# EAGLE design Powersupply V1.10_final (EAGLE 7.2.0)
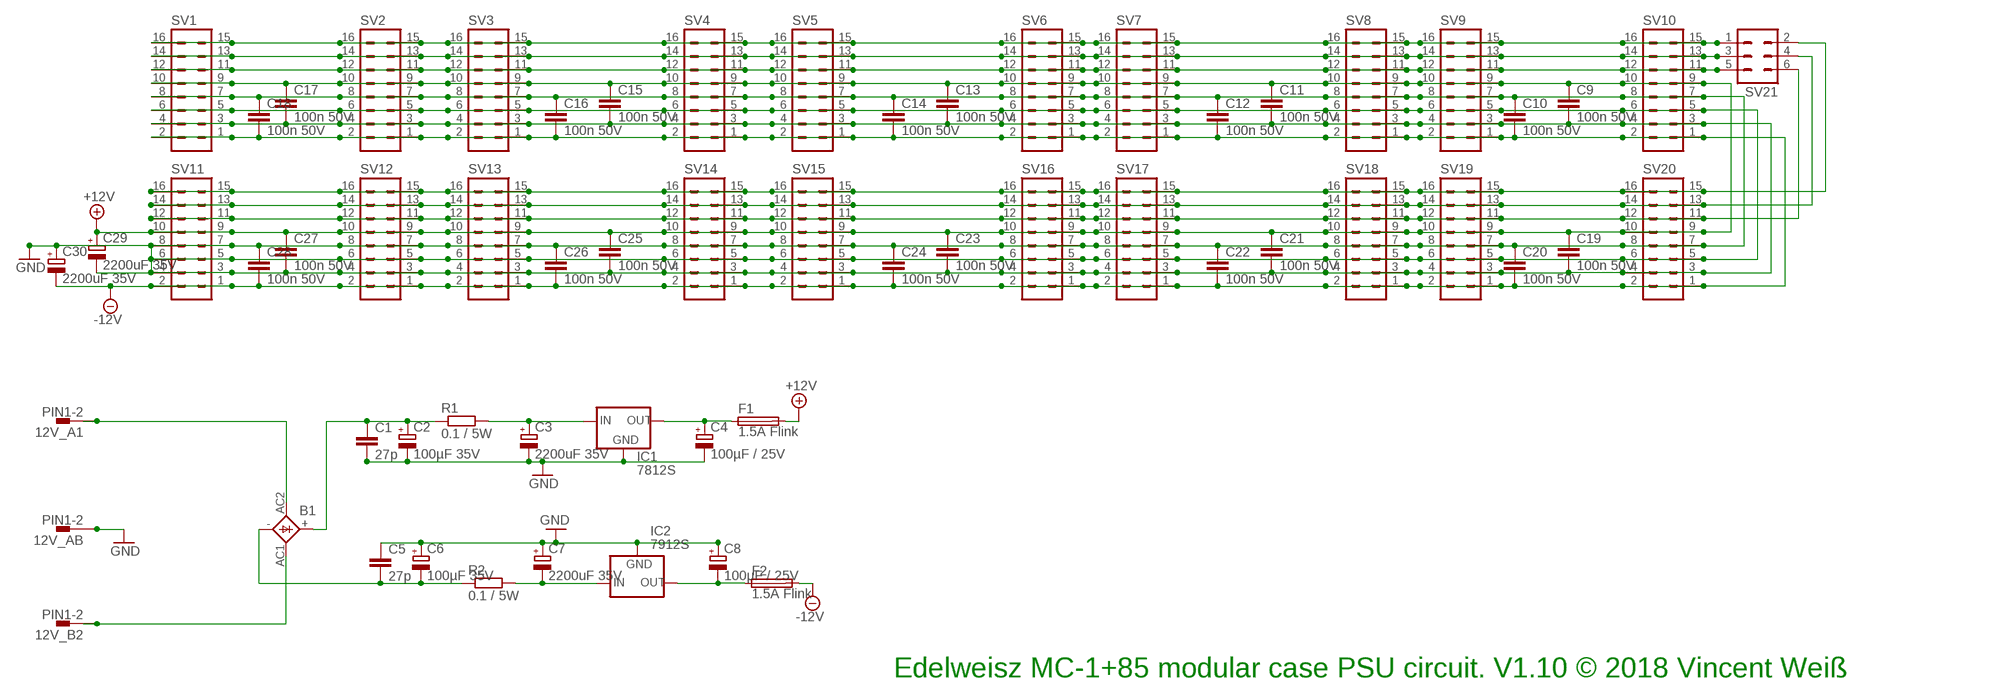
[diagram p0: schematic, sheet 1]

## Parts
12V_A1  PIN1-2  [62221]
12V_AB  PIN1-2  [62221]
12V_B2  PIN1-2  [62221]
B1  GBU4  [GBU4S]
C1  27p  C-EU050-024X044  [C050-024X044]
C2  100µF 35V  CPOL-EUE2.5-7  [E2,5-7]
C3  2200uF 35V  CPOL-EUE7.5-16  [E7,5-16]
C4  100µF / 25V  CPOL-EUE2.5-7  [E2,5-7]
C5  27p  C-EU050-024X044  [C050-024X044]
C6  100µF 35V  CPOL-EUE2.5-7  [E2,5-7]
C7  2200uF 35V  CPOL-EUE7.5-16  [E7,5-16]
C8  100µF / 25V  CPOL-EUE2.5-7  [E2,5-7]
C9  100n 50V  C-EU025-025X050  [C025-025X050]
C10  100n 50V  C-EU025-025X050  [C025-025X050]
C11  100n 50V  C-EU025-025X050  [C025-025X050]
C12  100n 50V  C-EU025-025X050  [C025-025X050]
C13  100n 50V  C-EU025-025X050  [C025-025X050]
C14  100n 50V  C-EU025-025X050  [C025-025X050]
C15  100n 50V  C-EU025-025X050  [C025-025X050]
C16  100n 50V  C-EU025-025X050  [C025-025X050]
C17  100n 50V  C-EU025-025X050  [C025-025X050]
C18  100n 50V  C-EU025-025X050  [C025-025X050]
C19  100n 50V  C-EU025-025X050  [C025-025X050]
C20  100n 50V  C-EU025-025X050  [C025-025X050]
C21  100n 50V  C-EU025-025X050  [C025-025X050]
C22  100n 50V  C-EU025-025X050  [C025-025X050]
C23  100n 50V  C-EU025-025X050  [C025-025X050]
C24  100n 50V  C-EU025-025X050  [C025-025X050]
C25  100n 50V  C-EU025-025X050  [C025-025X050]
C26  100n 50V  C-EU025-025X050  [C025-025X050]
C27  100n 50V  C-EU025-025X050  [C025-025X050]
C28  100n 50V  C-EU025-025X050  [C025-025X050]
C29  2200uF 35V  CPOL-EUE7.5-16  [E7,5-16]
C30  2200uF 35V  CPOL-EUE7.5-16  [E7,5-16]
F1  1.5A Flink  SH22,5  [SH22,5]
F2  1.5A Flink  SH22,5  [SH22,5]
IC1  7812S  78XXS  [78XXS]
IC2  7912S  79XXS  [79XXS]
R1  0.1 / 5W  R-EU_0613/15  [P0613/15]
R2  0.1 / 5W  R-EU_0613/15  [P0613/15]
SV1  ML16  [ML16]
SV2  ML16  [ML16]
SV3  ML16  [ML16]
SV4  ML16  [ML16]
SV5  ML16  [ML16]
SV6  ML16  [ML16]
SV7  ML16  [ML16]
SV8  ML16  [ML16]
SV9  ML16  [ML16]
SV10  ML16  [ML16]
SV11  ML16  [ML16]
SV12  ML16  [ML16]
SV13  ML16  [ML16]
SV14  ML16  [ML16]
SV15  ML16  [ML16]
SV16  ML16  [ML16]
SV17  ML16  [ML16]
SV18  ML16  [ML16]
SV19  ML16  [ML16]
SV20  ML16  [ML16]
SV21  MA03-2  [MA03-2]

## Nets
+12V: C9.1 C11.1 C13.1 C15.1 C17.1 C19.1 C21.1 C23.1 C25.1 C27.1 C29.+ F1.2 SV1.9 SV1.10 SV2.9 SV2.10 SV3.9 SV3.10 SV4.9 SV4.10 SV5.9 SV5.10 SV6.9 SV6.10 SV7.9 SV7.10 SV8.9 SV8.10 SV9.9 SV9.10 SV10.9 SV10.10 SV11.9 SV11.10 SV12.9 SV12.10 SV13.9 SV13.10 SV14.9 SV14.10 SV15.9 SV15.10 SV16.9 SV16.10 SV17.9 SV17.10 SV18.9 SV18.10 SV19.9 SV19.10 SV20.9 SV20.10
-12V: C10.2 C12.2 C14.2 C16.2 C18.2 C20.2 C22.2 C24.2 C26.2 C28.2 C30.- F2.2 SV1.1 SV1.2 SV2.1 SV2.2 SV3.1 SV3.2 SV4.1 SV4.2 SV5.1 SV5.2 SV6.1 SV6.2 SV7.1 SV7.2 SV8.1 SV8.2 SV9.1 SV9.2 SV10.1 SV10.2 SV11.1 SV11.2 SV12.1 SV12.2 SV13.1 SV13.2 SV14.1 SV14.2 SV15.1 SV15.2 SV16.1 SV16.2 SV17.1 SV17.2 SV18.1 SV18.2 SV19.1 SV19.2 SV20.1 SV20.2
GND: 12V_AB.1 C1.2 C2.- C3.- C4.- C5.1 C6.+ C7.+ C8.+ C9.2 C10.1 C11.2 C12.1 C13.2 C14.1 C15.2 C16.1 C17.2 C18.1 C19.2 C20.1 C21.2 C22.1 C23.2 C24.1 C25.2 C26.1 C27.2 C28.1 C29.- C30.+ IC1.GND IC2.GND SV1.3 SV1.4 SV1.5 SV1.6 SV1.7 SV1.8 SV2.3 SV2.4 SV2.5 SV2.6 SV2.7 SV2.8 SV3.3 SV3.4 SV3.5 SV3.6 SV3.7 SV3.8 SV4.3 SV4.4 SV4.5 SV4.6 SV4.7 SV4.8 SV5.3 SV5.4 SV5.5 SV5.6 SV5.7 SV5.8 SV6.3 SV6.4 SV6.5 SV6.6 SV6.7 SV6.8 SV7.3 SV7.4 SV7.5 SV7.6 SV7.7 SV7.8 SV8.3 SV8.4 SV8.5 SV8.6 SV8.7 SV8.8 SV9.3 SV9.4 SV9.5 SV9.6 SV9.7 SV9.8 SV10.3 SV10.4 SV10.5 SV10.6 SV10.7 SV10.8 SV11.3 SV11.4 SV11.5 SV11.6 SV11.7 SV11.8 SV12.3 SV12.4 SV12.5 SV12.6 SV12.7 SV12.8 SV13.3 SV13.4 SV13.5 SV13.6 SV13.7 SV13.8 SV14.3 SV14.4 SV14.5 SV14.6 SV14.7 SV14.8 SV15.3 SV15.4 SV15.5 SV15.6 SV15.7 SV15.8 SV16.3 SV16.4 SV16.5 SV16.6 SV16.7 SV16.8 SV17.3 SV17.4 SV17.5 SV17.6 SV17.7 SV17.8 SV18.3 SV18.4 SV18.5 SV18.6 SV18.7 SV18.8 SV19.3 SV19.4 SV19.5 SV19.6 SV19.7 SV19.8 SV20.3 SV20.4 SV20.5 SV20.6 SV20.7 SV20.8
N$1: B1.- C5.2 C6.- R2.1
N$2: 12V_A1.1 B1.AC2(AC1)
N$3: 12V_B2.1 B1.AC1(AC2)
N$4: B1.+ C1.1 C2.+ R1.1
N$5: C3.+ IC1.IN R1.2
N$6: C7.- IC2.IN R2.2
N$7: C4.+ F1.1 IC1.OUT
N$8: C8.- F2.1 IC2.OUT
N$9: SV1.15 SV1.16 SV2.15 SV2.16 SV3.15 SV3.16 SV4.15 SV4.16 SV5.15 SV5.16 SV6.15 SV6.16 SV7.15 SV7.16 SV8.15 SV8.16 SV9.15 SV9.16 SV10.15 SV10.16 SV21.1
N$10: SV1.13 SV1.14 SV2.13 SV2.14 SV3.13 SV3.14 SV4.13 SV4.14 SV5.13 SV5.14 SV6.13 SV6.14 SV7.13 SV7.14 SV8.13 SV8.14 SV9.13 SV9.14 SV10.13 SV10.14 SV21.3
N$11: SV1.11 SV1.12 SV2.11 SV2.12 SV3.11 SV3.12 SV4.11 SV4.12 SV5.11 SV5.12 SV6.11 SV6.12 SV7.11 SV7.12 SV8.11 SV8.12 SV9.11 SV9.12 SV10.11 SV10.12 SV21.5
N$17: SV11.11 SV11.12 SV12.11 SV12.12 SV13.11 SV13.12 SV14.11 SV14.12 SV15.11 SV15.12 SV16.11 SV16.12 SV17.11 SV17.12 SV18.11 SV18.12 SV19.11 SV19.12 SV20.11 SV20.12 SV21.6
N$18: SV11.13 SV11.14 SV12.13 SV12.14 SV13.13 SV13.14 SV14.13 SV14.14 SV15.13 SV15.14 SV16.13 SV16.14 SV17.13 SV17.14 SV18.13 SV18.14 SV19.13 SV19.14 SV20.13 SV20.14 SV21.4
N$19: SV11.15 SV11.16 SV12.15 SV12.16 SV13.15 SV13.16 SV14.15 SV14.16 SV15.15 SV15.16 SV16.15 SV16.16 SV17.15 SV17.16 SV18.15 SV18.16 SV19.15 SV19.16 SV20.15 SV20.16 SV21.2

## Notes on the sheet
- Edelweisz MC-1+85 modular case PSU circuit. V1.10 © 2018 Vincent Weiß

## Library data of the parts
12V_A1 12V_AB 12V_B2 = con-faston:PIN1-2: CONN TAB FASTON BRASS .187 PCB TAB, FSSTON, DUAL STAKE, .187 SERIES Digi-Key Part Number: A24734CT-ND Source: Tyco Electronics Corporation .. ENG_CD_62221_R.pdf http://search.digikey.com/scripts/DkSearch/dksus.dll?Detail&name=A24734CT-ND; MF: TYCO ELECTRONICS; MPN: 62221-1; OC_FARNELL: unknown; OC_NEWARK: 16H2318
B1 = rectifier:GBU4: GENERAL INSTRUMENT RECTIFIER
C1 C5 C9-C28 = rcl:C-EU: CAPACITOR, European symbol
C2-C4 C6-C8 C29 C30 = rcl:CPOL-EU: POLARIZED CAPACITOR, European symbol
F1 F2 = fuse:SH22,5: FUSE HOLDER grid 22,5 mm, OGN0031 8201, Schurter (Buerklin); MF: SCHURTER; MPN: 0031.8201; OC_FARNELL: 1162740; OC_NEWARK: 96F8317
IC1 = v-reg:78XXS: VOLTAGE REGULATOR
IC2 = v-reg:79XXS: VOLTAGE REGULATOR
R1 R2 = rcl:R-EU_: RESISTOR, European symbol
SV1-SV20 = con-harting-ml:ML16: HARTING; OC_FARNELL: unknown; OC_NEWARK: unknown
SV21 = con-lstb:MA03-2: PIN HEADER; OC_FARNELL: unknown; OC_NEWARK: unknown

## Board
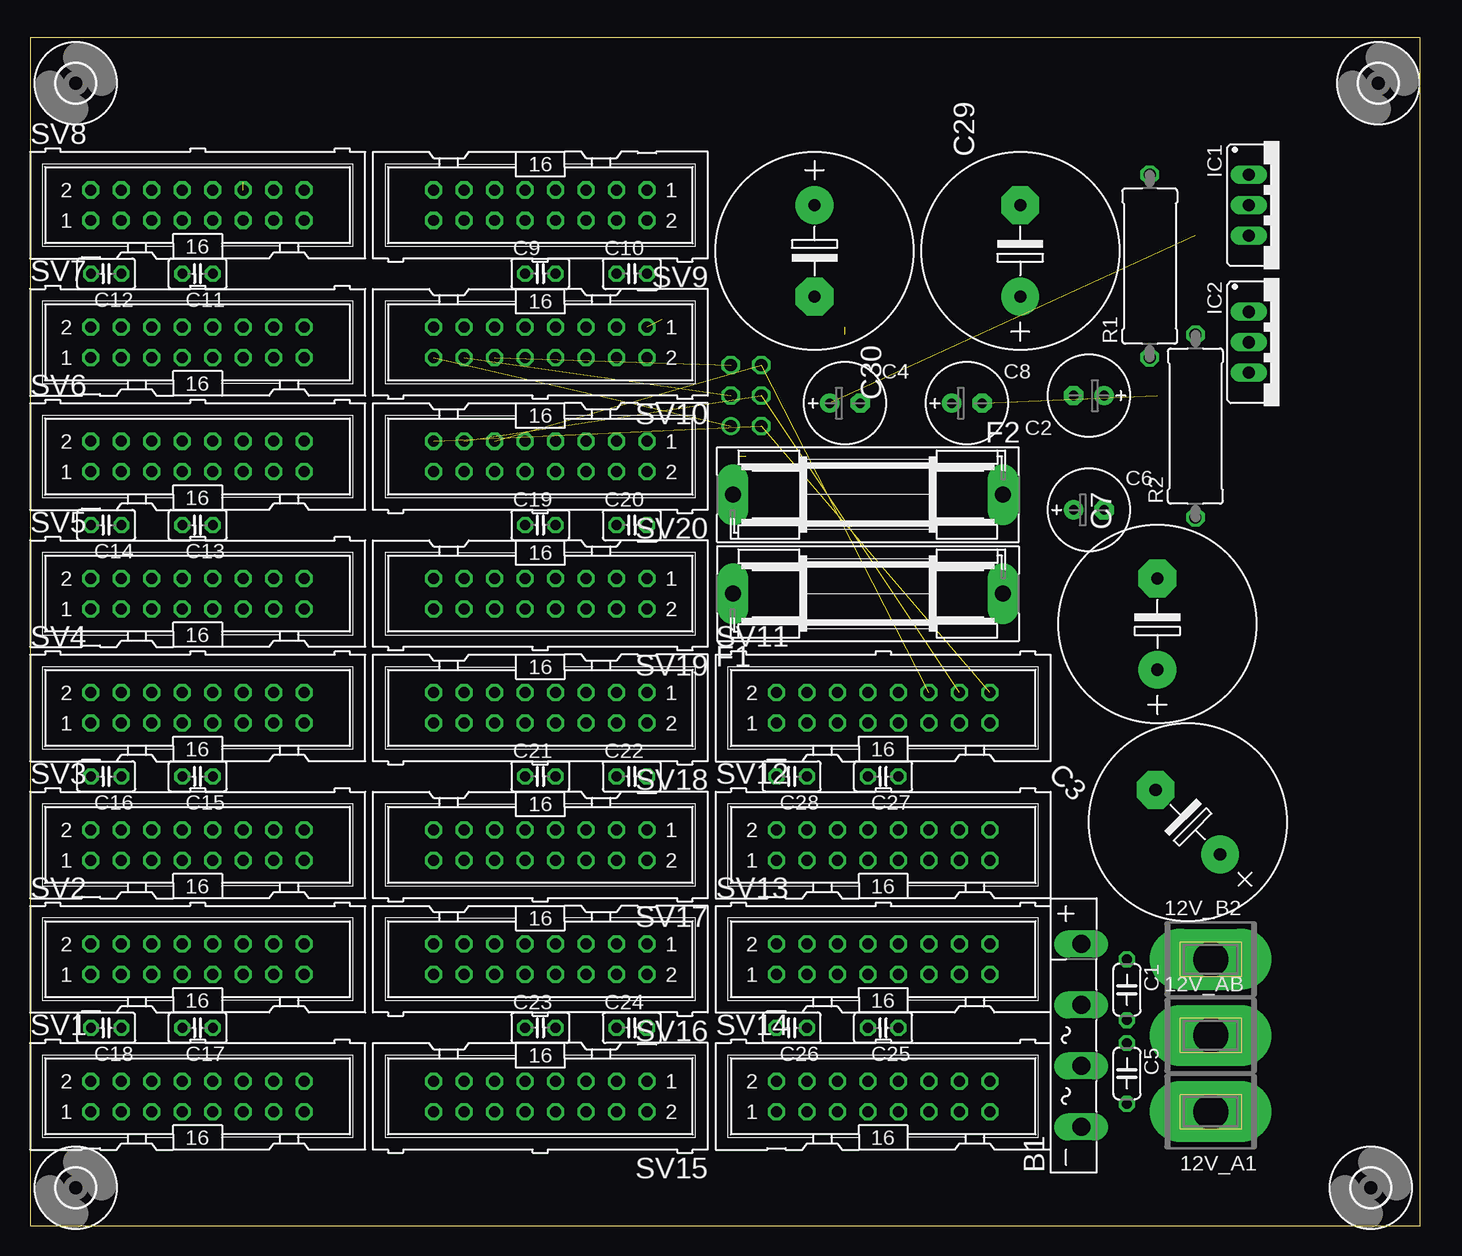
[diagram p1: board, top side]
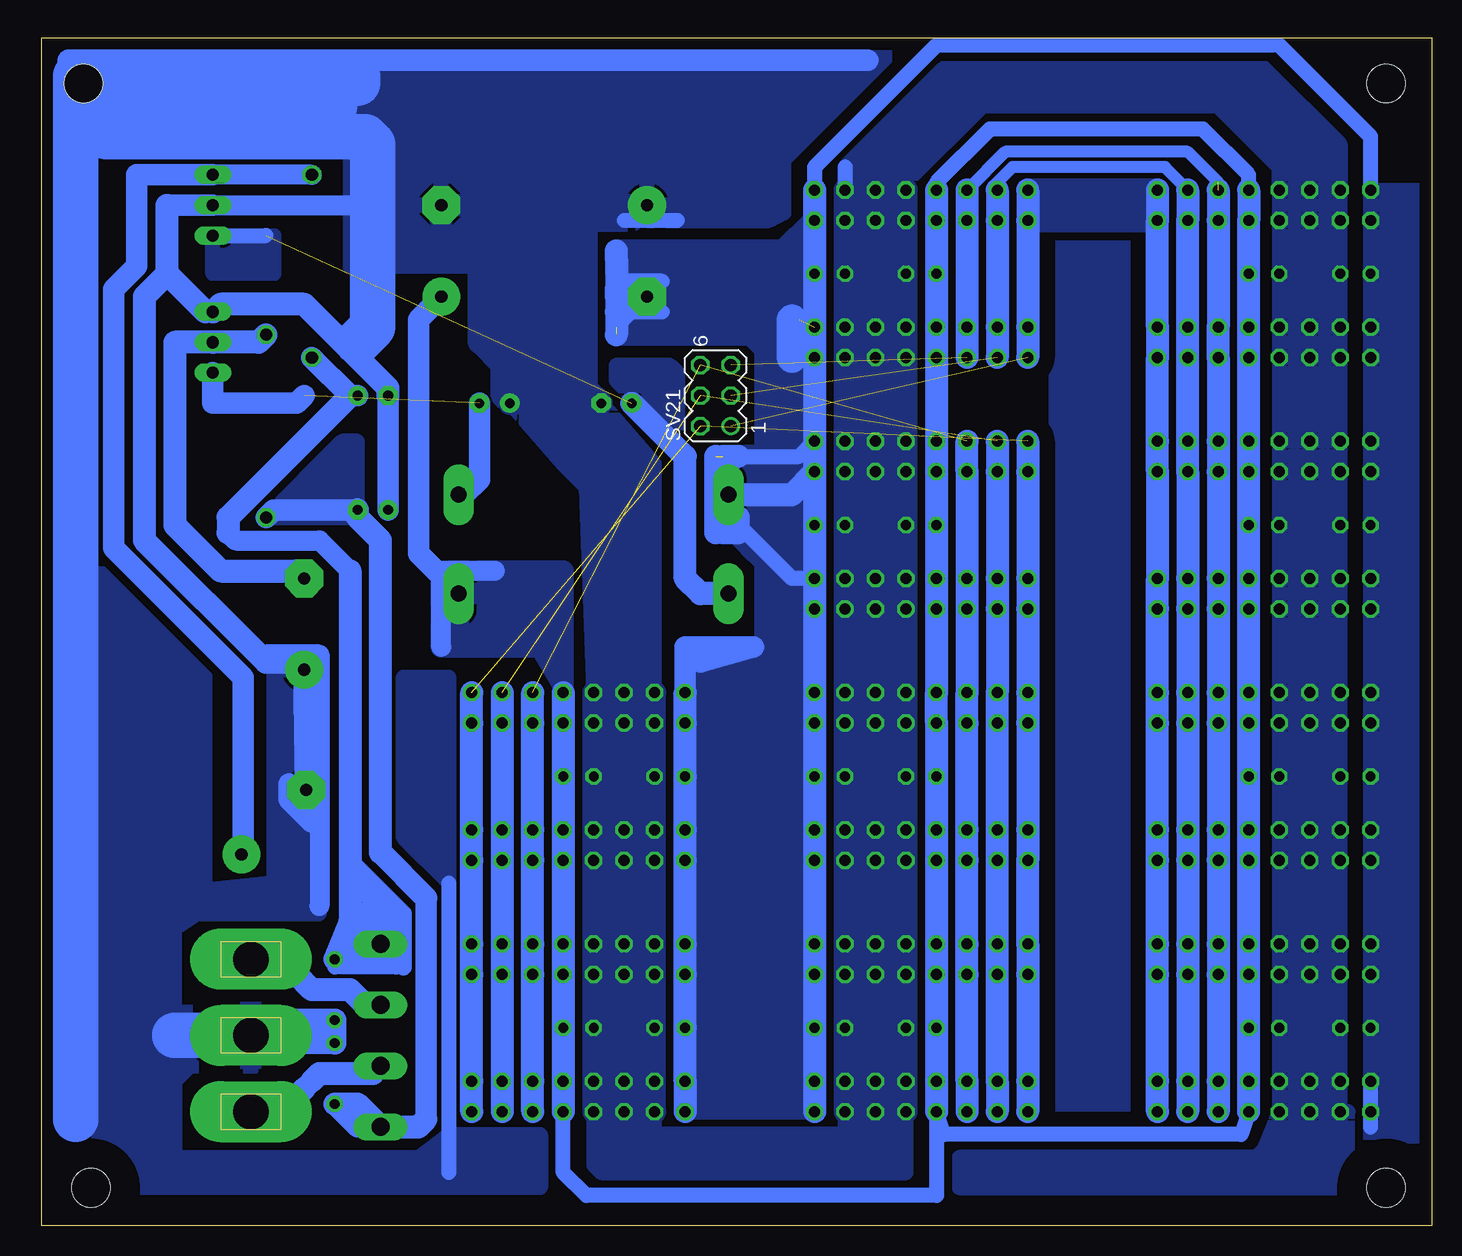
[diagram p2: board, bottom side, seen from below]

Size 115.88 x 99.05 mm. Coordinates in mm from the lower left corner, seen from the top.
Outline: 0,0 115.88,0 115.88,99.05 0,99.05 0,0
Copper layers (1*16): Top 0.035mm / dielectric 1.5mm / Bottom 0.035mm
Design rules "default": minimum track width 10mil, minimum drill 24mil, track to track 8mil, track to pad 8mil, pad to pad 8mil, via to via 8mil, smd to smd 8mil, copper to edge 40mil, drill to drill 8mil, minimum pad ring 10mil, minimum via ring 8mil, stop-mask expansion 4mil, vias tented up to drill 0mil, thermal gap 10mil

### Footprints (pad centres in the part's own frame; a part is rotated, then mirrored left to right if it is on the bottom)
62221 = drill 2.921 pad 5.08 long: 1 0,0
GBU4S = drill 1.499 long: + 7.62,0; - -7.62,0; AC1 2.54,0; AC2 -2.54,0
C050-024X044 = drill 0.813 octagon: 1 -2.54,0; 2 2.54,0
E2,5-7 = drill 0.813 pad 1.6: + -1.27,0 | drill 0.813 pad 1.6 octagon: - 1.27,0
E7,5-16 = drill 1.016 pad 3.15: + -3.81,0 | drill 1.016 pad 3.15 octagon: - 3.81,0
C025-025X050 = drill 0.813 octagon: 1 -1.27,0; 2 1.27,0
SH22,5 = drill 1.321 pad 2.54 long: 1 -11.252,0; 2 11.252,0
78XXS = drill 1.016 long: GND 0,-2.54; IN -2.54,-2.54; OUT 2.54,-2.54
79XXS = drill 1.016 long: GND -2.54,-2.54; IN 0,-2.54; OUT 2.54,-2.54
P0613/15 = drill 1.016 octagon: 1 -7.62,0; 2 7.62,0
ML16 = drill 0.914 octagon: 1 -8.89,-1.27; 2 -8.89,1.27; 3 -6.35,-1.27; 4 -6.35,1.27; 5 -3.81,-1.27; 6 -3.81,1.27; 7 -1.27,-1.27; 8 -1.27,1.27; 9 1.27,-1.27; 10 1.27,1.27; 11 3.81,-1.27; 12 3.81,1.27; 13 6.35,-1.27; 14 6.35,1.27; 15 8.89,-1.27; 16 8.89,1.27
MA03-2 = drill 1.016: 1 -2.54,-1.27 | drill 1.016 octagon: 2 -2.54,1.27; 3 0,-1.27; 4 0,1.27; 5 2.54,-1.27; 6 2.54,1.27
3,2 = hole 3.2: 0,0

### Placement (x,y rotation side)
12V_A1  98.42,9.52 180 top
12V_AB  98.42,15.88 0 top
12V_B2  98.42,22.23 0 top
B1  87.63,15.88 90 top
C1  91.44,19.69 270 top
C2  88.27,69.22 180 top
C3  96.52,33.66 135 top
C4  67.94,68.58 0 top
C5  91.44,12.7 270 top
C6  88.27,59.69 0 top
C7  93.98,50.16 90 top
C8  78.11,68.58 0 top
C9  42.55,79.38 0 top
C10  50.16,79.38 0 top
C11  13.97,79.38 180 top
C12  6.35,79.38 180 top
C13  13.97,58.42 180 top
C14  6.35,58.42 180 top
C15  13.97,37.46 180 top
C16  6.35,37.46 180 top
C17  13.97,16.51 180 top
C18  6.35,16.51 180 top
C19  42.55,58.42 0 top
C20  50.16,58.42 0 top
C21  42.55,37.46 0 top
C22  50.16,37.46 0 top
C23  42.55,16.51 0 top
C24  50.16,16.51 0 top
C25  71.12,16.51 180 top
C26  63.5,16.51 180 top
C27  71.12,37.46 180 top
C28  63.5,37.46 180 top
C29  82.55,81.28 90 top
C30  65.41,81.28 270 top
F1  69.85,52.7 0 top
F2  69.85,60.96 180 top
IC1  104.14,85.09 270 top
IC2  104.14,73.66 270 top
R1  93.34,80.01 90 top
R2  97.16,66.67 90 top
SV1  13.97,10.79 0 top
SV2  13.97,22.23 0 top
SV3  13.97,31.75 0 top
SV4  13.97,43.18 0 top
SV5  13.97,52.7 0 top
SV6  13.97,64.13 0 top
SV7  13.97,73.66 0 top
SV8  13.97,85.09 0 top
SV9  42.55,85.09 180 top
SV10  42.55,73.66 180 top
SV11  71.12,43.18 0 top
SV12  71.12,31.75 0 top
SV13  71.12,22.23 0 top
SV14  71.12,10.79 0 top
SV15  42.55,10.79 180 top
SV16  42.55,22.23 180 top
SV17  42.55,31.75 180 top
SV18  42.55,43.18 180 top
SV19  42.55,52.7 180 top
SV20  42.55,64.13 180 top
SV21  59.69,69.22 90 bottom
U$1  [3,2]  3.81,95.25 0 top
U$2  [3,2]  112.39,95.25 0 top
U$3  [3,2]  3.81,3.17 0 top
U$4  [3,2]  111.76,3.17 0 top

### Tracks (layer width: path | path; a pad name or v marks a point on that pad's centre or on a via)
+12V
  Bottom 1.27: SV8.10 15.24,87.63 19.05,91.44 36.83,91.44 41.27,86.99 SV9.9 | SV1.9 15.88,7.62 40.64,7.62 SV15.10 41.27,2.54 70.48,2.54 72.39,4.44 SV14.9
  Bottom 1.676: 78.11,54.61 82.55,54.61 82.55,48.26
  Bottom 1.778: C29.+ 84.45,75.56 84.45,56.06 F1.2
  Bottom 1.93: SV1.9 SV1.10 C17.1 SV2.9 SV2.10 SV3.9 SV3.10 C15.1 SV4.9 SV4.10 SV5.9 SV5.10 C13.1 SV6.9 SV6.10 SV7.9 SV7.10 C11.1 SV8.9 SV8.10 | SV9.10 SV9.9 C9.1 SV10.9 SV10.10 SV20.9 SV20.10 C19.1 SV19.9 SV19.10 SV18.9 SV18.10 C21.1 SV17.9 SV17.10 SV16.9 SV16.10 C23.1 SV15.9 SV15.10 | SV11.10 SV11.9 C27.1 SV12.10 SV12.9 SV13.10 SV13.9 C25.1 SV14.10 SV14.9
  pour Bottom: 72.39,45.09 72.39,54.61 82.55,54.61 82.55,48.26 74.3,48.26
-12V  (3 unrouted)
  Bottom 1.27: SV8.2 5.08,90.8 12.7,98.42 41.27,98.42 51.44,88.27 SV9.1 | 5.08,8.25 SV1.2 | 59.05,64.13 52.7,64.13 SV20.1 SV19.1 53.34,53.98 58.42,59.05 | 64.14,78.74 67.94,78.74 67.94,74.93 66.67,76.2 64.14,76.2 | 52.7,75.56 53.34,75.56
  Bottom 1.778: SV11.2 62.23,48.26 56.52,48.26 60.96,46.99
  Bottom 1.93: SV9.2 SV9.1 C10.2 SV10.1 SV10.2 SV20.1 SV20.2 | SV20.2 C20.2 SV19.1 SV19.2 SV18.1 SV18.2 C22.2 SV17.1 SV17.2 SV16.1 SV16.2 C24.2 SV15.1 SV15.2 | SV14.1 SV14.2 C26.2 SV13.1 SV13.2 SV12.1 SV12.2 C28.2 SV11.1 SV11.2 | F2.2 53.34,60.96 SV20.2 | 57.78,64.13 59.05,64.13 59.05,57.79 57.78,57.79 57.78,59.05 | 67.94,81.28 67.94,80.64 67.94,74.29 | 59.69,64.13 59.69,57.79
  Bottom 2.54: 53.34,75.56 53.34,72.39
  pour Bottom: 5.08,86.36 0.64,86.36 0.64,6.98 5.08,6.98
  pour Bottom: 51.44,72.39 53.34,74.29 67.94,74.29 67.94,81.28 54.61,81.28 53.98,81.28 51.44,83.82
  pour Bottom: 58.42,64.13 58.42,57.79 51.44,57.79 51.44,64.77 52.07,64.13
  pour Bottom: 51.44,44.45 62.23,44.45 62.23,9.52 51.44,9.52
  pour Bottom: 51.44,58.42 55.88,58.42 58.42,60.96 58.42,57.79 57.15,56.52 55.88,55.25 55.88,49.53 55.88,48.9 56.52,48.26 58.42,48.26 62.23,44.45 62.23,41.91 51.44,41.91
  pour Bottom: 58.42,60.96 51.44,60.96 51.44,74.93 57.78,74.93 55.88,73.02 55.88,66.04 55.88,64.13
GND
  Bottom 1.27: 48.9,88.27 SV9.3 | 81.92,4.44 81.92,28.58 | 62.87,83.82 67.31,83.82
  Bottom 1.422: 89.53,73.66 90.17,73.66 90.49,73.34 | 92.71,39.37 92.71,34.29 92.71,26.67
  Bottom 1.676: IC1.GND 89.53,85.09 | 97.16,47.62 92.71,47.62 92.71,26.67
  Bottom 1.778: 105.41,85.09 IC1.GND | C2.- C6.+ | 46.99,97.16 113.67,97.16 | 95.25,36.83 95.25,35.56 93.34,33.66
  Bottom 1.93: C3.- C7.+ 94.61,46.99 97.16,46.99 107.31,57.15 107.31,77.47 105.41,79.38 | 105.41,79.38 105.41,85.09 | 105.41,79.38 102.23,76.2 IC2.GND 100.97,76.83 93.98,76.83 90.49,73.34 87,69.85 C2.- | C1.2 C5.1 97.79,15.24 12V_AB.1 97.16,17.14 C1.2
  Bottom 3.81: 12V_AB.1 104.78,15.88 | 89.53,95.25 89.53,95.88 113.03,95.88 113.03,8.89 | 91.44,93.34 110.49,93.34 110.49,90.8 88.9,90.8 88.27,90.17 88.27,74.93 89.53,73.66
  pour Bottom: 12.7,9.52 7.62,9.52 7.62,86.36 12.7,86.36
  pour Bottom: 43.81,86.36 48.9,86.36 48.9,9.52 43.81,9.52
  pour Bottom: 64.77,44.45 69.85,44.45 69.85,9.52 64.77,9.52
  pour Bottom: 69.22,68.58 76.83,68.58 77.47,69.22 77.47,71.75 79.38,73.66 79.38,80.64 82.55,83.82 82.55,85.09 65.41,85.09 66.67,83.82 68.58,83.82 70.48,83.82 70.48,69.85
  pour Bottom: 12.7,86.36 12.7,88.27 17.78,93.34 18.41,93.34 37.47,93.34 43.81,86.99 43.81,86.36 48.9,86.36 48.9,88.27 40.64,96.52 40.01,96.52 15.24,96.52 13.97,96.52 7.62,90.17 7.62,86.36
  pour Bottom: 48.9,9.52 48.9,7.62 64.77,7.62 64.77,9.52 69.85,9.52 69.85,5.08 69.22,4.44 43.81,4.44 43.81,9.52
  pour Bottom: 64.77,44.45 64.77,63.5 69.22,68.58 76.83,68.58 72.39,63.5 71.12,62.23 70.48,61.59 69.85,44.45
  pour Bottom: 102.87,13.97 95.25,13.97 95.25,17.78 102.87,17.78
  pour Bottom: 81.92,7.62 74.3,7.62 74.3,3.17 107.95,3.17 107.95,17.78 102.87,17.78 102.87,13.97 104.78,12.06 104.78,5.71 84.45,5.71
  pour Bottom: 81.92,28.58 81.92,45.72 85.72,45.72 85.72,32.38
  pour Bottom: 106.68,13.34 95.25,13.34 95.25,17.78 104.78,17.78 104.78,24.77 102.87,26.03 92.71,26.03 92.71,47.62 96.52,47.62 96.52,28.58 102.87,27.94 106.68,24.77
  pour Bottom: 12.7,9.52 13.97,6.35 14.61,5.71 39.37,5.71 39.37,3.17 2.54,3.17 1.91,3.17 1.91,5.08 6.35,5.08 6.99,5.71 6.99,9.52 7.62,9.52
  pour Bottom: 65.41,85.09 65.41,83.82 55.24,83.82 53.98,84.45 53.98,88.9 44.45,98.42 90.17,98.42 90.17,80.01 80.01,80.01
  pour Bottom: 102.23,26.67 102.23,45.72 111.12,54.61 111.12,3.81 104.78,3.81 104.78,24.77 102.87,26.67
N$1
  Bottom 1.778: B1.- 89.53,8.25 C5.2 | C6.- 96.52,59.69 R2.1 | 83.82,8.89 83.82,27.3
  Bottom 1.93: C5.2 89.53,10.16 B1.- 84.45,8.25 83.82,8.89 | 83.82,27.3 87.63,31.12 87.63,57.15 89.53,59.05 C6.-
  pour Bottom: 89.53,59.69 89.53,65.41 90.81,65.41 97.16,59.05 89.53,59.05
N$2
  Bottom 1.422: 93.98,11.43 93.34,12.06
  Bottom 1.778: 92.71,12.7 94.61,10.79
  Bottom 1.93: 95.89,9.52 94.61,10.79 93.98,11.43 | 93.34,12.06 92.71,12.7 88.27,12.7 B1.AC2
  Bottom 3.81: 12V_A1.1 95.89,9.52
N$3
  Bottom 1.93: B1.AC1 88.9,18.41 90.17,19.69 93.34,19.69 94.61,20.95 94.61,22.23
  Bottom 2.54: 94.61,22.23 12V_B2.1
N$4
  Bottom 1.27: B1.+ 86.36,24.13 | 86.36,22.23 86.36,21.59 91.44,21.59 C1.1 | 90.17,25.4 86.36,22.23 | 86.36,22.23 86.36,24.13 | 86.36,24.13 89.53,24.13
  Bottom 1.422: C1.1 87.63,22.23
  Bottom 1.676: 100.33,57.79 99.69,57.15 92.71,57.15 90.17,54.61
  Bottom 1.778: B1.+ 90.17,23.49 90.17,25.4 | C2.+ 90.17,69.22 R1.1
  Bottom 1.93: 90.17,69.22 100.33,59.05 100.33,57.79 | 90.17,54.61 90.17,25.4 C1.1
  pour Bottom: 85.72,21.59 85.72,26.03 90.17,26.03 90.81,21.59
N$5
  Bottom 1.676: R1.2 IC1.IN
  Bottom 1.778: IC1.IN 107.95,87.63 107.95,80.01 109.86,78.1 109.86,56.52 99.06,45.72 99.06,31.12 C3.+
N$6
  Bottom 1.93: R2.2 97.79,73.66 IC2.IN 104.78,73.66 104.78,58.42 100.97,54.61 94.61,54.61 C7.-
N$7  (1 unrouted)
  Bottom 1.27: IC1.OUT 97.16,82.55
  Bottom 1.93: F1.1 60.96,52.7 62.23,53.98 62.23,64.13 C4.+
  pour Bottom: 101.6,82.55 96.52,82.55 96.52,79.38 101.6,79.38
  pour Bottom: 66.67,69.22 67.94,70.48 67.94,71.75 63.5,71.75 62.87,71.12 62.87,66.67 64.77,68.58 66.67,68.58
N$8  (1 unrouted)
  Bottom 1.778: F2.1 80.64,60.96 79.38,62.23 C8.- | IC2.OUT 101.6,68.58 94.61,68.58 93.98,69.22
N$9  (1 unrouted)
  Bottom 1.93: SV1.15 SV1.16 SV2.15 SV2.16 SV3.15 SV3.16 SV4.15 SV4.16 SV5.15 SV5.16 SV6.15 SV6.16 SV7.15 SV7.16 SV8.15 SV8.16 | SV9.15 SV9.16 SV10.15 SV10.16
  pour Bottom: 22.86,86.36 33.66,86.36 33.66,83.82 22.86,83.82
N$10  (1 unrouted)
  Bottom 1.016: SV8.14 22.23,88.27 34.92,88.27 36.2,86.99 SV9.13
  Bottom 1.93: SV8.14 SV8.13 SV7.14 SV7.13 SV6.14 SV6.13 SV5.14 SV5.13 SV4.14 SV4.13 SV3.14 SV3.13 SV2.14 SV2.13 SV1.14 SV1.13 | SV9.14 SV9.13 SV10.13 SV10.14
N$11  (2 unrouted)
  Bottom 1.016: 17.78,86.99 20.32,89.53 35.56,89.53 SV9.11
  Bottom 1.93: SV8.12 SV8.11 SV7.12 SV7.11 SV6.12 SV6.11 SV5.12 SV5.11 SV4.12 SV4.11 SV3.12 SV3.11 SV2.12 SV2.11 SV1.12 SV1.11 | SV9.12 SV9.11 SV10.11 SV10.12
N$12
  Bottom 1.93: 67.94,78.1 67.94,77.47 67.94,76.2
N$15
  Bottom 1.93: 52.7,74.29 52.7,73.02
N$16
  Bottom 1.778: 86.36,26.03 89.53,26.03
N$17  (2 unrouted)
  Bottom 1.93: SV15.12 SV15.11 SV16.12 SV16.11 SV17.12 SV17.11 SV18.12 SV18.11 SV19.12 SV19.11 SV20.12 SV20.11 | SV14.11 SV14.12 SV13.11 SV13.12 SV12.11 SV12.12 SV11.11 SV11.12
N$18  (2 unrouted)
  Bottom 1.93: SV20.13 SV20.14 SV19.13 SV19.14 SV18.13 SV18.14 SV17.13 SV17.14 SV16.13 SV16.14 SV15.13 SV15.14 | SV11.14 SV11.13 SV12.14 SV12.13 SV13.14 SV13.13 SV14.14 SV14.13
N$19  (2 unrouted)
  Bottom 1.93: SV20.15 SV20.16 SV19.15 SV19.16 SV18.15 SV18.16 SV17.15 SV17.16 SV16.15 SV16.16 SV15.15 SV15.16 | SV14.15 SV14.16 SV13.15 SV13.16 SV12.15 SV12.16 SV11.15 SV11.16
N$23
  pour Bottom (isolate 1.27): 24.77,81.91 31.75,81.91 31.75,9.52 24.77,9.52
N$24
  Bottom 1.422: 85.72,21.59 85.72,26.03 89.53,29.84 88.27,26.67
N$25
  Bottom 1.422: 88.9,24.77 86.36,24.77